# EasyEDA schematic SP26_brainstim3_VCCS Schematic(easyEDA STD)_BenFerguson.json
TITLE: Voltage Controlled Current Source w/ Feedback; REV: 1.0; Date: 2026-02-11; Sheet: 1/1; Drawn By: bsferguson; Company: UW-Madison
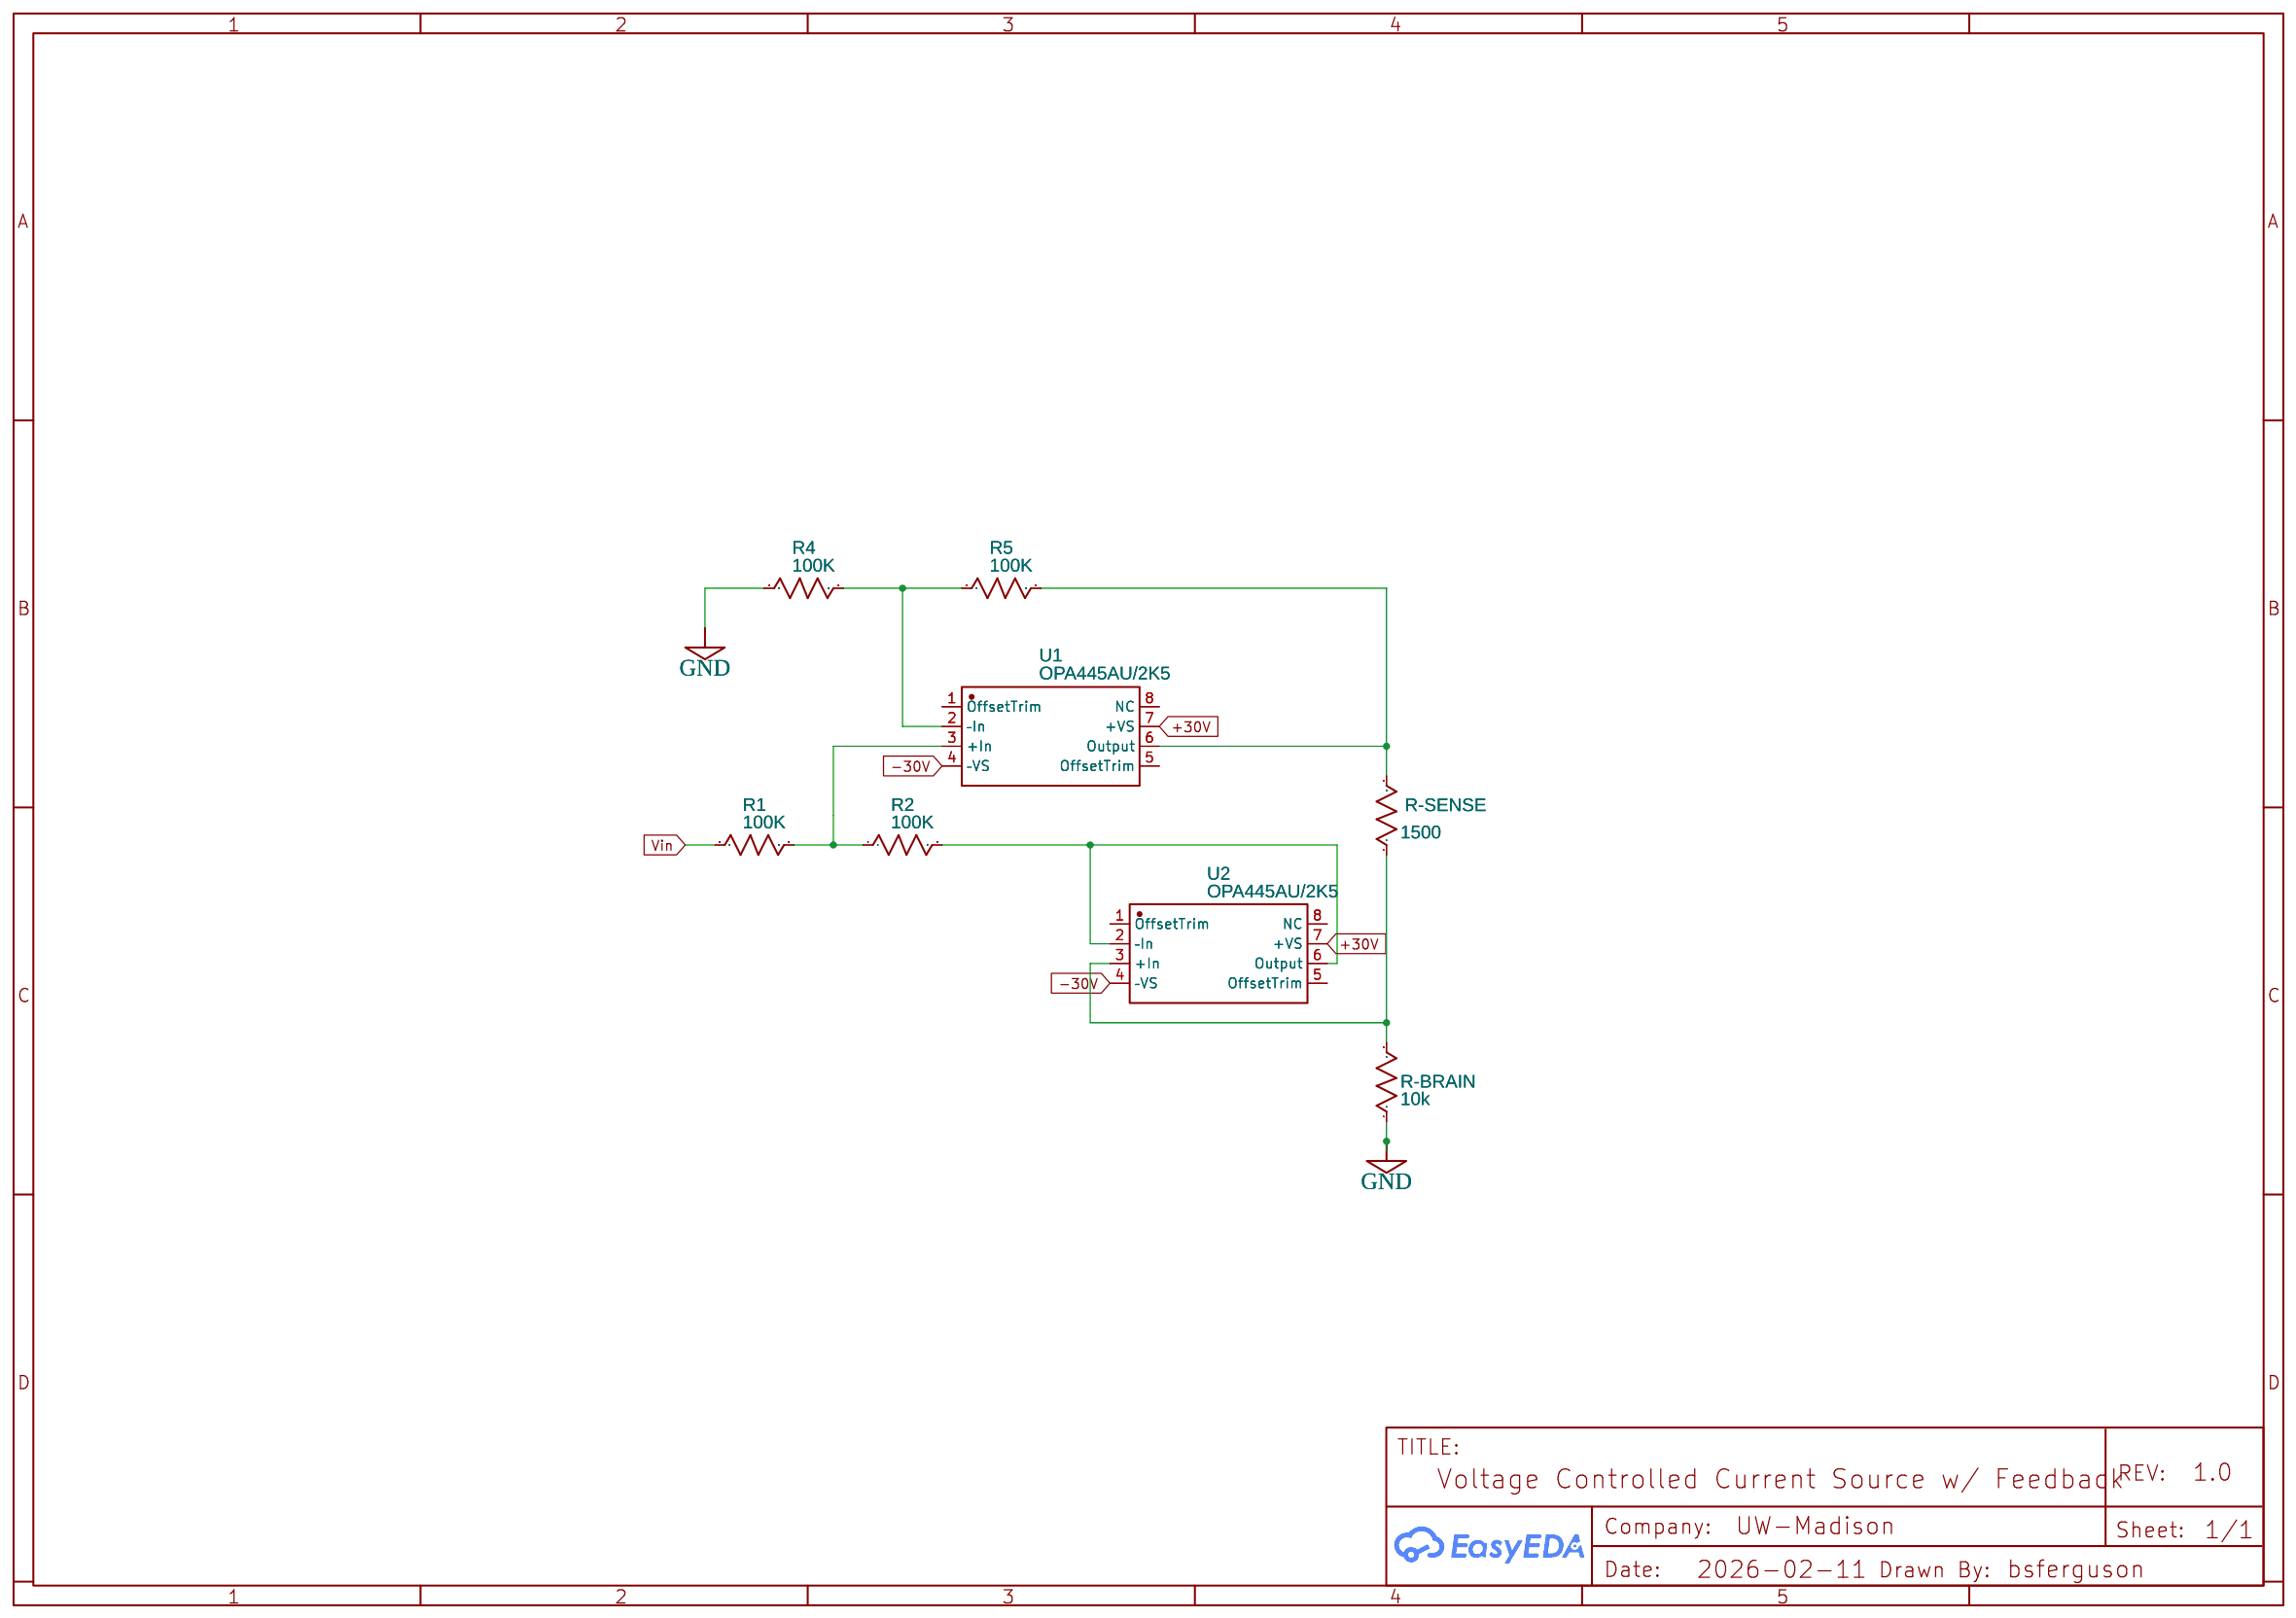
[diagram p0: schematic sheet]

## Parts
R1  100K  [R0603]
R2  100K  [R0603]
R4  100K  [R0603]
R5  100K  [R0603]
R-BRAIN  10k  [R0603]
R-SENSE  1500  [R0603]
U1  OPA445AU/2K5  [SOIC-8_L4.9-W3.9-P1.27-LS6.0-BL]
U2  OPA445AU/2K5  [SOIC-8_L4.9-W3.9-P1.27-LS6.0-BL]

## Library data of the parts
R1 R2 R4 R5 R-BRAIN R-SENSE = R_0603_US: Contributor: LCEDA_Lib
U1 U2 = OPA445AU/2K5: Contributor: LCSC; Supplier: LCSC; Supplier Part: C1348606; Manufacturer: TI(德州仪器); JLCPCB Part Class: Extended Part

## Nets
+30V: U1.7(+VS) U2.7(+VS)
-30V: U1.4(–VS) U2.4(–VS)
GND: R4.1 R-BRAIN.1
Vin: R1.1
Net-(R1-2): R1.2 R2.1 U1.3(+In)
Net-(R2-2): R2.2 U2.2(–In) U2.6(Output)
Net-(R4-2): R4.2 R5.1 U1.2(–In)
Net-(R5-2): R5.2 R-SENSE.2 U1.6(Output)
Net-(R-BRAIN-2): R-BRAIN.2 R-SENSE.1 U2.3(+In)

Not connected (* = marked no-connect by the designer): U1 1(OffsetTrim) 5(OffsetTrim) 8(NC); U2 1(OffsetTrim) 5(OffsetTrim) 8(NC)
